# EAGLE schematic schematic_v2 (EAGLE 6.1)
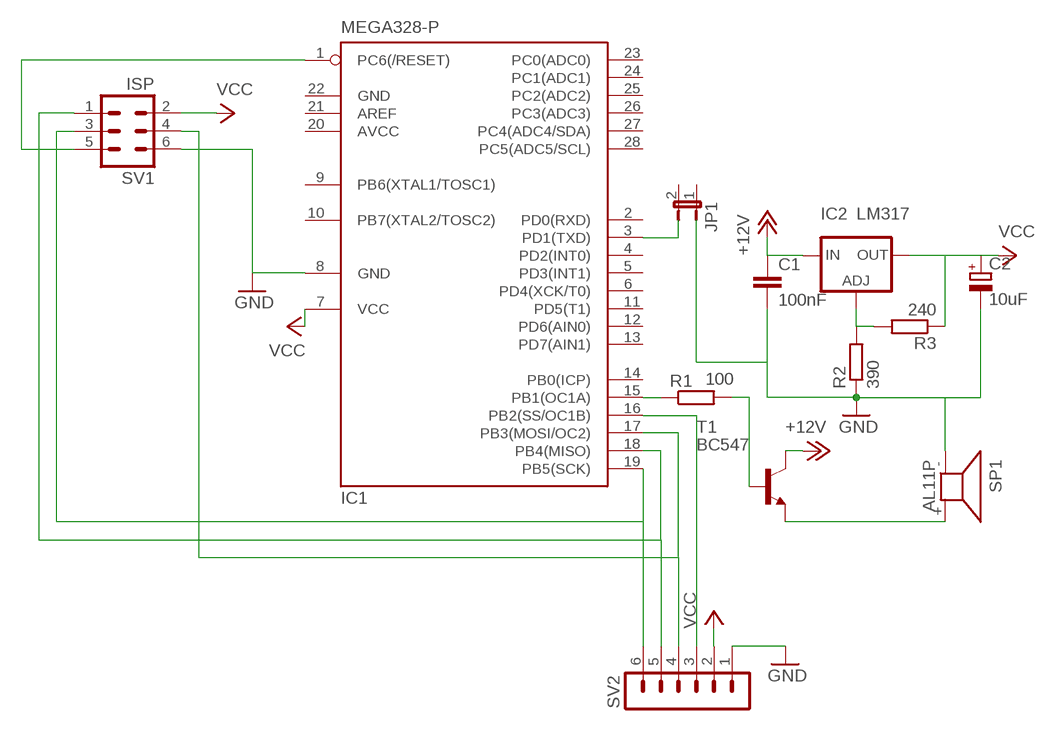
[diagram p0: schematic, sheet 1]

## Parts
C1  100nF  C-EU025-025X050  [C025-025X050]
C2  10uF  CPOL-EU085CS-1R  [085CS_1R]
IC1  MEGA328-P  MEGA8-P  [DIL28-3]
IC2  LM317  LM317TS  [317TS]
JP1  JP1E  [JP1]
R1  100  R-EU_0204/5  [0204/5]
R2  390  R-EU_0204/5  [0204/5]
R3  240  R-EU_0204/5  [0204/5]
SP1  AL11P  [AL11P]
SV1  ISP  MA03-2  [MA03-2]
SV2  MA06-1  [MA06-1]
T1  BC547  [TO92]

## Nets
+12V: C1.1 IC2.3(IN) T1.3(C)
GND: C1.2 C2.- IC1.8(GND) R2.1 SP1.- SV1.6 SV2.1
N$1: IC1.1(PC6(/RESET)) SV1.5
N$2: IC1.19(PB5(SCK)) SV1.3 SV2.6
N$3: IC1.18(PB4(MISO)) SV1.1 SV2.5
N$4: IC1.17(PB3(MOSI/OC2)) SV1.4 SV2.4
N$5: IC1.3(PD1(TXD))
N$6: IC1.16(PB2(SS/OC1B)) SV2.3
N$7: SP1.+ T1.1(E)
N$8: IC1.15(PB1(OC1A)) R1.1
N$9: R1.2 T1.2(B)
N$10: IC2.1(ADJ) R2.2 R3.2
VCC: C2.+ IC1.7(VCC) IC2.2(OUT) R3.1 SV1.2 SV2.2
Unconnected: IC1.2(PD0(RXD)) IC1.4(PD2(INT0)) IC1.5(PD3(INT1)) IC1.6(PD4(XCK/T0)) IC1.9(PB6(XTAL1/TOSC1)) IC1.10(PB7(XTAL2/TOSC2)) IC1.11(PD5(T1)) IC1.12(PD6(AIN0)) IC1.13(PD7(AIN1)) IC1.14(PB0(ICP)) IC1.21(AREF) IC1.23(PC0(ADC0)) IC1.24(PC1(ADC1)) IC1.25(PC2(ADC2)) IC1.26(PC3(ADC3)) IC1.27(PC4(ADC4/SDA)) IC1.28(PC5(ADC5/SCL)) JP1.1 JP1.2

## Power pins joined to a net without a drawn wire
AVCC: IC1.20(AVCC)
GND: IC1.22(GND)

## Library data of the parts
C1 = rcl:C-EU: CAPACITOR, European symbol
C2 = rcl:CPOL-EU: POLARIZED CAPACITOR, European symbol
IC1 = atmel:MEGA8-P: MICROCONTROLLER 8 Kbytes FLASH, 1 kbytes SRAM, 512 bytes EEPROM, USART, 4-channel 10 bit ADC, 2-channel 8 bit ADC Pin compatible with Atmega48, ATMega88, ATMega168 Source: avr.lbr; OC_FARNELL: unknown; OC_NEWARK: unknown
IC2 = v-reg:LM317TS: VOLTAGE REGULATOR
JP1 = jumper:JP1E: JUMPER
R1-R3 = rcl:R-EU_: RESISTOR, European symbol
SP1 = buzzer:AL11P: SPEAKER Source: Buerklin; OC_FARNELL: unknown; OC_NEWARK: unknown
SV1 = con-lstb:MA03-2: PIN HEADER; OC_FARNELL: unknown; OC_NEWARK: unknown
SV2 = con-lstb:MA06-1: PIN HEADER; OC_FARNELL: unknown; OC_NEWARK: unknown
T1 = transistor:BC547: NPN TRANSISTOR